# EAGLE design openfc_imu (EAGLE 6.2)
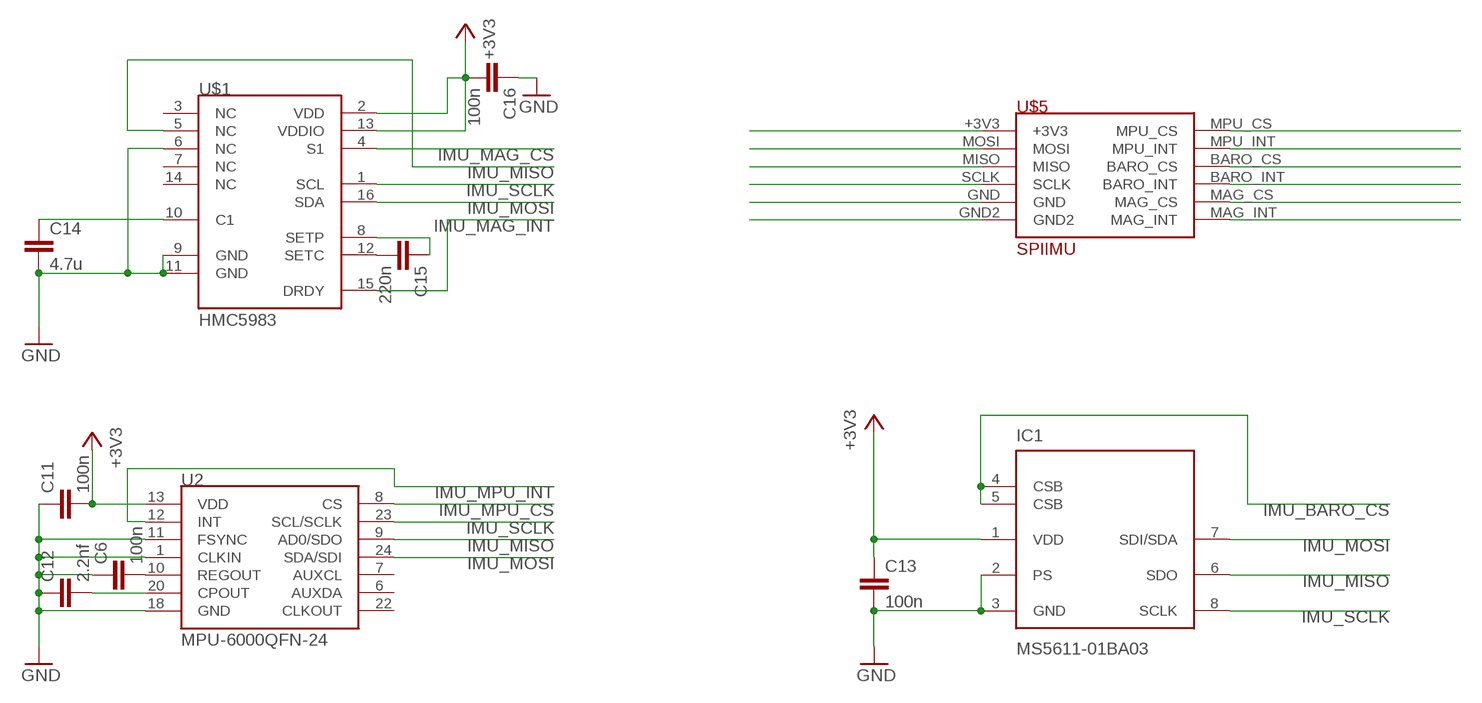
[diagram p0: schematic, sheet 1]

## Parts
C6  100n  C-EUC0603  [C0603]
C11  100n  C-EUC0603  [C0603]
C12  2.2nf  C-EUC0603  [C0603]
C13  100n  C-EUC0603  [C0603]
C14  4.7u  C-EUC0603  [C0603]
C15  220n  C-EUC0603  [C0603]
C16  100n  C-EUC0603  [C0603]
IC1  MS5611-01BA03  [SON125P300X500X100-8N]
U2  MPU-6000QFN-24  [QFN-24-TESTING]
U$1  HMC5983  HMC5883LSMD  [16LPCC]
U$5  SPIIMU  [SPIIMU]

## Nets
IMU+3V3: C11.2 C13.1 C16.2 IC1.1(VDD) U2.13(VDD) U$1.2(VDD) U$1.13(VDDIO) U$5.+3V3 ; supply symbol labelled +3V3
IMU_BARO_CS: IC1.4(CSB) IC1.5(CSB) U$5.BARO_CS
IMU_BARO_INT: U$5.BARO_INT
IMU_GND: C6.1 C11.1 C12.1 C13.2 C14.2 C16.1 IC1.2(PS) IC1.3(GND) U2.1(CLKIN) U2.11(FSYNC) U2.18(GND) U$1.6(NC) U$1.9(GND) U$1.11(GND) U$5.GND U$5.GND2 ; supply symbol labelled GND
IMU_MAG_CS: U$1.4(S1) U$5.MAG_CS
IMU_MAG_INT: U$1.15(DRDY) U$5.MAG_INT
IMU_MISO: IC1.6(SDO) U2.9(AD0/SDO) U$1.5(NC) U$5.MISO
IMU_MOSI: IC1.7(SDI/SDA) U2.24(SDA/SDI) U$1.16(SDA) U$5.MOSI
IMU_MPU_CS: U2.8(CS) U$5.MPU_CS
IMU_MPU_INT: U2.12(INT) U$5.MPU_INT
IMU_SCLK: IC1.8(SCLK) U2.23(SCL/SCLK) U$1.1(SCL) U$5.SCLK
N$3: C6.2 U2.10(REGOUT)
N$4: C14.1 U$1.10(C1)
N$5: C12.2 U2.20(CPOUT)
N$7: C15.1 U$1.8(SETP)
N$8: C15.2 U$1.12(SETC)
Unconnected: U2.6(AUXDA) U2.7(AUXCL) U2.22(CLKOUT) U$1.3(NC) U$1.7(NC) U$1.14(NC)

## Library data of the parts
C6 C11-C16 = rcl:C-EU: CAPACITOR, European symbol
IC1 = Measurement-Specialties:MS5611-01BA03: Variometer Module, with stainless steel cap
U2 = SparkFun-Sensors:MPU-6000: MPU-6000 - I2C address is 0x68 with AD0 low and 0x69 with AD0 high.
U$1 = SparkFun-Sensors:HMC5883L: 3 Axis Digital Compass IC
U$5 = spiimu:SPIIMU

## Board
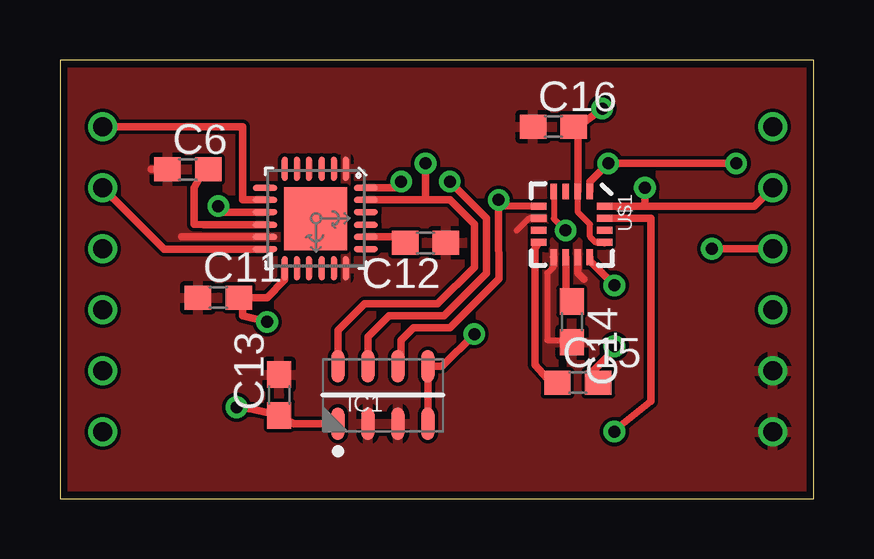
[diagram p1: board, top side]
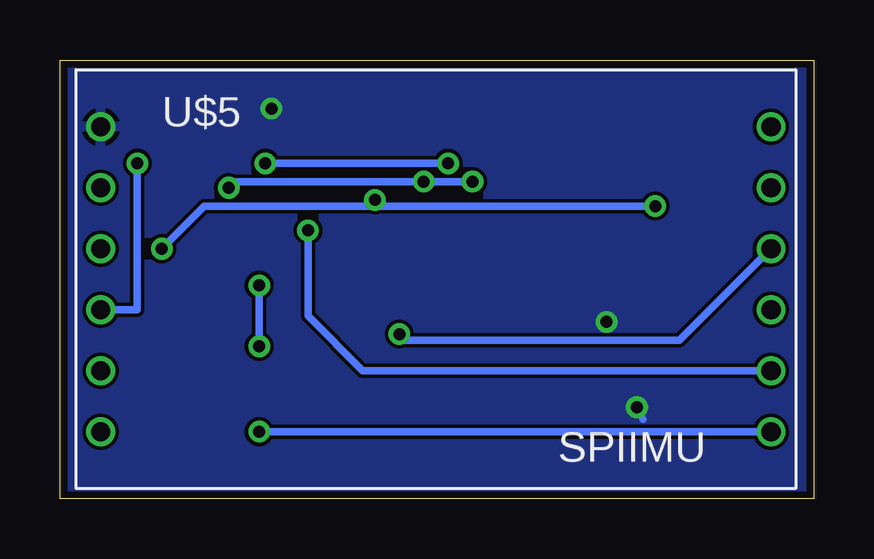
[diagram p2: board, bottom side, seen from below]

Size 31.42 x 18.28 mm. Coordinates in mm from the lower left corner, seen from the top.
Outline: 0,0 31.42,0 31.42,18.28 0,18.28 0,0
Copper layers (1*16): Top 0.035mm / dielectric 1.5mm / Bottom 0.035mm
Design rules: minimum track width 0.15mm, minimum drill 0.3mm, track to track 0.15mm, track to pad 0.15mm, pad to pad 0.15mm, via to via 0.15mm, smd to smd 0.15mm, copper to edge 0.3mm, drill to drill 0.2mm, minimum pad ring 0.2mm, minimum via ring 0.15mm, stop-mask expansion 0.075mm, vias tented up to drill 0mil, thermal gap 0.2mm

### Footprints (pad centres in the part's own frame; a part is rotated, then mirrored left to right if it is on the bottom)
C0603 = smd 1.1 x 1: 1 -0.85,0; 2 0.85,0
SON125P300X500X100-8N = smd 1.35 x 0.55: 1 -1.2,1.875; 2 -1.2,0.625; 3 -1.2,-0.625; 4 -1.2,-1.875; 5 1.2,-1.875; 6 1.2,-0.625; 7 1.2,0.625; 8 1.2,1.875
QFN-24-TESTING = smd 1.016 x 0.254: 1 -2.066,1.257; 2 -2.066,0.75; 3 -2.066,0.247; 4 -2.066,-0.287; 5 -2.066,-0.792; 6 -2.066,-1.297; 13 2.086,-1.297; 14 2.086,-0.792; 15 2.086,-0.287; 16 2.086,0.247; 17 2.086,0.75; 18 2.086,1.257 | smd 0.254 x 1.016: 7 -1.267,-2.122; 8 -0.762,-2.122; 9 -0.258,-2.122; 10 0.278,-2.122; 11 0.78,-2.122; 12 1.287,-2.122; 19 1.287,2.082; 20 0.78,2.082; 21 0.278,2.082; 22 -0.258,2.082; 23 -0.762,2.082; 24 -1.267,2.082 | smd 2.616 x 2.616: P$1 0.02,-0.01
16LPCC = smd 0.65 x 0.28: 1 -1.37,0.75; 2 -1.37,0.25; 3 -1.37,-0.25; 4 -1.37,-0.75; 9 1.37,-0.75; 10 1.37,-0.25; 11 1.37,0.25; 12 1.37,0.75 | smd 0.28 x 0.65: 5 -0.75,-1.37; 6 -0.25,-1.37; 7 0.25,-1.37; 8 0.75,-1.37; 13 0.75,1.37; 14 0.25,1.37; 15 -0.25,1.37; 16 -0.75,1.37
SPIIMU = drill 0.8: +3V3 -13.97,6.35; BARO_CS 13.97,1.27; BARO_INT 13.97,-1.27; GND -13.97,-3.81; GND2 -13.97,-6.35; MAG_CS 13.97,-3.81; MAG_INT 13.97,-6.35; MISO -13.97,1.27; MOSI -13.97,3.81; MPU_CS 13.97,6.35; MPU_INT 13.97,3.81; SCLK -13.97,-1.27

### Placement (x,y rotation side)
C6  5.33,13.72 0 top
C11  6.6,8.38 0 top
C12  15.24,10.67 180 top
C13  9.14,4.32 90 top
C14  21.34,7.37 270 top
C15  21.59,4.83 0 top
C16  20.57,15.49 0 top
IC1  13.46,4.32 90 top
U2  10.67,11.68 270 top
U$1  21.34,11.43 270 top
U$5  15.75,9.14 0 bottom

### Tracks (layer width: path | path; a pad name or v marks a point on that pad's centre or on a via)
IMU+3V3  (via drill 0.5)
  Top 0.254: 22.69,10.67 22.35,10.67 22.1,10.92 22.1,11.43 21.59,11.94 U$1.2
  Top 0.305: U$1.2 21.59,15.33 | 21.59,15.33 C16.2 | U2.13 9.37,9.12 8.64,8.38 7.62,8.38 | 7.62,8.38 C11.2 | IC1.1 9.75,3.12 C13.1 8.04,3.72 v7.37,3.81 | 21.59,15.33 21.59,15.49 v22.61,16.26 | 22.69,10.67 U$1.13 | 7.62,8.38 7.62,7.62 v8.64,7.37
  Bottom 0.305: v22.61,16.26 22.86,16.26 | v8.64,7.37 8.38,7.37 | v7.37,3.81 7.11,3.3
  pour Bottom: -3.3,19.3 32.26,19.3 32.26,-3.56 -3.3,-3.56
IMU_BARO_CS  (via drill 0.5)
  Top 0.305: IC1.4 IC1.5 15.93,5.52 v17.27,6.86
  Bottom 0.305: v17.27,6.86 17.02,6.6 5.59,6.6 U$5.BARO_CS
IMU_GND
  Top 0.254: 20.59,9.92 20.59,9.66 20.32,9.4 20.32,6.6 20.99,6.6 C14.2 | U$1.6 19.56,11.68 19.05,11.18
  Top 0.305: 20.57,10.07 U$1.9 20.59,9.92 | 20.99,6.86 C14.2 | 3.81,13.72 C6.1 | U2.11 7.38,10.9 | 7.38,10.9 7.37,10.92 | 7.38,10.9 5.1,10.9 5.08,10.92 | U$1.11 21.59,9.4 21.84,9.14
  pour Top: -4.57,20.57 33.53,20.57 33.53,-4.83 -4.57,-4.83
IMU_MAG_CS  (via drill 0.5)
  Top 0.254: U$1.4 20.59,11.67 v21.08,11.18
  Bottom 0.305: v21.08,11.18 21.08,7.62 18.8,5.33 U$5.MAG_CS
IMU_MAG_INT  (via drill 0.5)
  Top 0.305: U$1.15 23.37,11.68 24.64,11.68 24.64,4.06 23.37,3.05 v23.11,2.79
  Bottom 0.305: v23.11,2.79 U$5.MAG_INT
IMU_MISO  (via drill 0.5)
  Top 0.305: U$1.5 18.28,12.2 | 18.28,12.2 v18.29,12.45 | v27.18,10.41 U$5.MISO | U2.9 6.86,11.94 v6.6,12.19 | 18.28,12.2 18.29,12.18 18.29,11.43 18.3,9.16 16.26,7.11 14.73,7.11 14.22,6.6 14.22,5.66 IC1.6
  Bottom 0.305: 18.29,12.19 25.4,12.19 v27.18,10.41 | v6.6,12.19 18.29,12.19 | 18.29,12.19 v18.29,12.45
IMU_MOSI  (via drill 0.5)
  Top 0.305: U$1.16 24.38,12.18 | 24.38,12.18 28.94,12.18 U$5.MOSI | U2.24 13.97,12.95 v14.22,13.21 | v24.38,12.95 24.38,12.18 | IC1.7 12.84,6.74 13.72,7.62 16,7.62 17.78,9.4 17.78,11.68 v16.26,13.21
  Bottom 0.305: v14.22,13.21 v16.26,13.21 24.13,13.21 v24.38,12.95
IMU_MPU_CS
  Top 0.305: U$5.MPU_CS 7.62,15.49 7.62,12.45 U2.8 | U2.8
IMU_MPU_INT
  Top 0.305: U2.12 4.34,10.4 U$5.MPU_INT
IMU_SCLK  (via drill 0.5)
  Top 0.305: U$1.1 22.09,13.2 v22.86,13.97 v28.19,13.97 | U2.23 15.24,12.45 | IC1.8 11.59,7.02 12.7,8.13 15.75,8.13 17.27,9.65 17.27,11.43 16.26,12.45 15.24,12.45 | v15.24,13.97 15.24,12.45 | 15.24,12.45
  Bottom 0.305: v28.19,13.97 28.19,7.87 U$5.SCLK | v15.24,13.97 v22.86,13.97
N$3
  Top 0.305: U2.10 5.98,11.41 5.59,11.43 5.59,12.95 5.93,13.55 C6.2
N$4
  Top 0.305: U$1.10 21.09,8.47 C14.1
N$5
  Top 0.305: U2.20 14.41,10.9 C12.2
N$7
  Top 0.305: U$1.8 19.81,10.43 19.81,5.59 20.47,4.84 20.47,5.18 20.57,4.83 C15.1
N$8  (via drill 0.5)
  Top 0.305: C15.2 22.09,5.18 23.11,6.21 v23.11,6.35 | U$1.12 22.09,9.92 v23.11,8.89
  Bottom 0.305: v23.11,8.89 v23.11,6.35